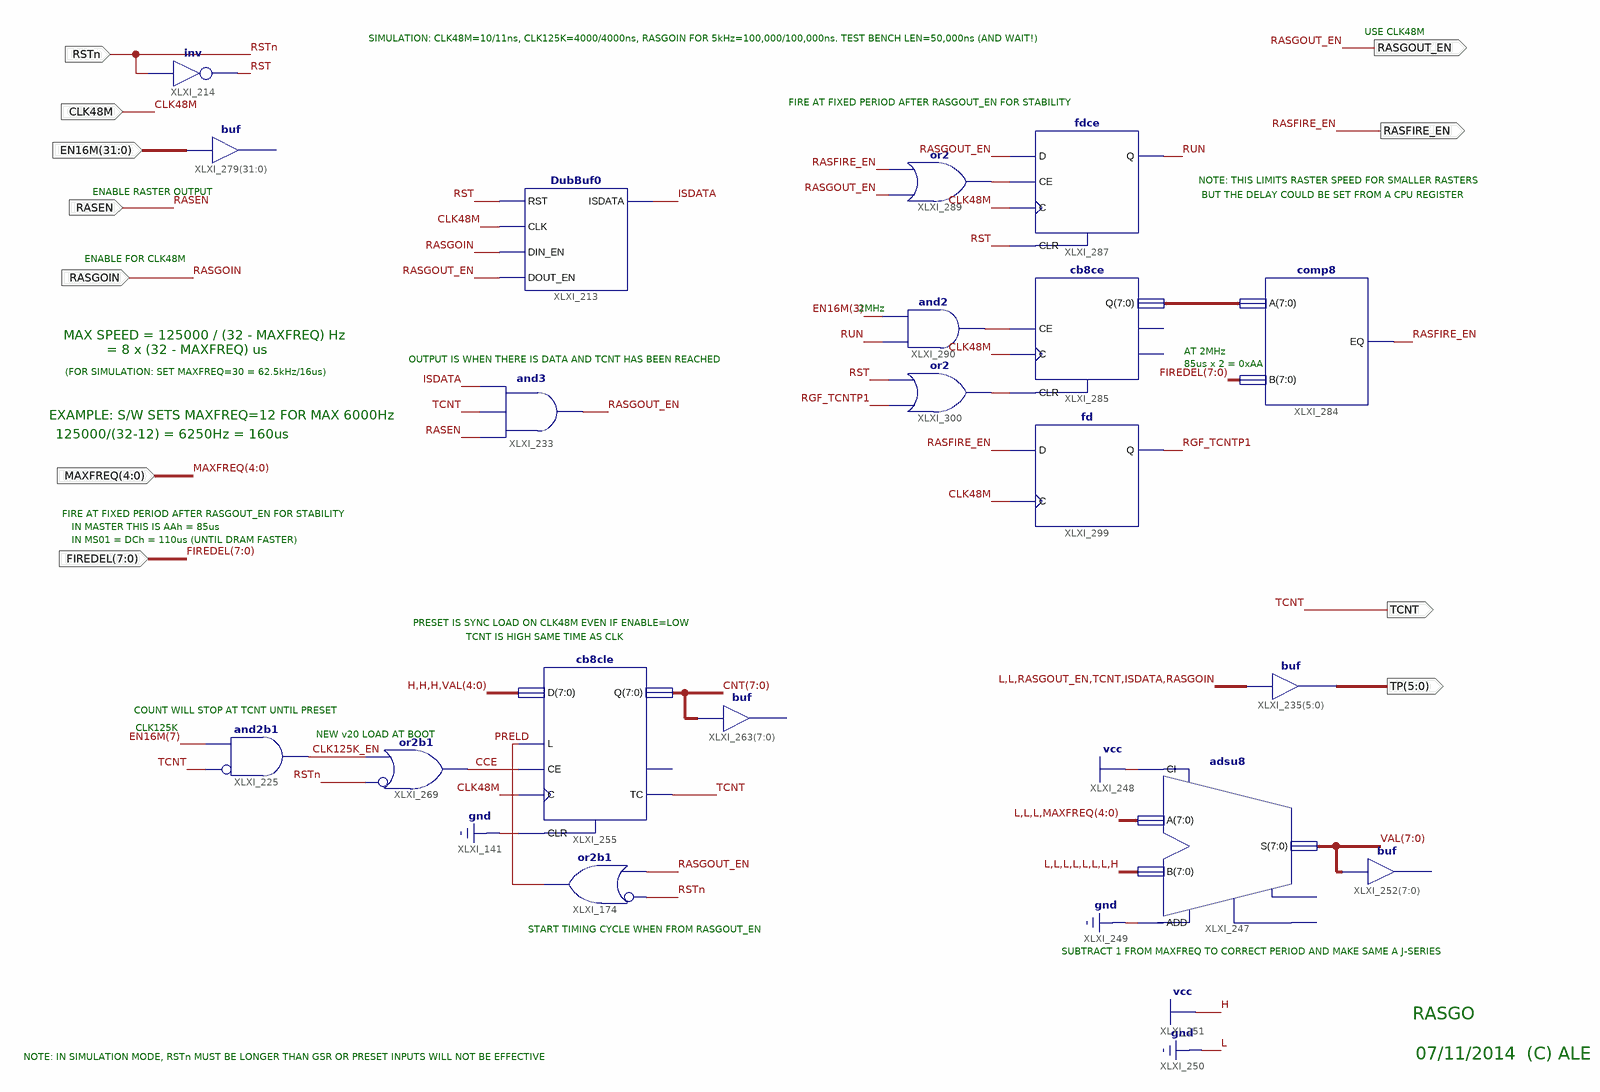
[diagram p0: schematic sheet 1]
// Xilinx ISE schematic RasGo.sch (zynq) as structural Verilog: 19 symbols, 11 ports
module RasGo (
  input  RASEN,
  input  RSTn,
  input  CLK48M,
  input  RASGOIN,
  input  [31:0] EN16M,
  input  [7:0] FIREDEL,
  input  [4:0] MAXFREQ,
  output RASGOUT_EN,
  output TCNT,
  output [5:0] TP,
  output RASFIRE_EN
);

  wire CCE, CLK125K_EN, ISDATA, PRELD, RGF_TCNTP1, RST, RUN, XLXN_504, XLXN_512, XLXN_543;
  wire [7:0] CNT, VAL, XLXN_535;

  not XLXI_214 (RST, RSTn);
  assign TP = {2'b00, RASGOUT_EN, TCNT, ISDATA, RASGOIN};  // buf XLXI_235[5..0], 6 bits wide
  adsu8 XLXI_247 (.A({3'b000, MAXFREQ}), .ADD(1'b0), .B(8'b00000001), .CI(1'b1), .S(VAL));  // open: CO, OFL
  // buf XLXI_252[7..0] has open pins: I=VAL, O=open
  // buf XLXI_279[31..0] has open pins: I=EN16M, O=open
  // buf XLXI_263[7..0] has open pins: I=CNT, O=open
  cb8cle XLXI_255 (
    .C(CLK48M), .CE(CCE), .CLR(1'b0), .D({3'b111, VAL[4:0]}), .L(PRELD), .Q(CNT), .TC(TCNT));  // open: CEO
  or XLXI_269 (CCE, ~RSTn, CLK125K_EN);  // or2b1
  or XLXI_174 (PRELD, ~RSTn, RASGOUT_EN);  // or2b1
  and XLXI_225 (CLK125K_EN, ~TCNT, EN16M[7]);  // and2b1
  and XLXI_233 (RASGOUT_EN, RASEN, TCNT, ISDATA);
  or XLXI_289 (XLXN_504, RASGOUT_EN, RASFIRE_EN);
  fdce XLXI_287 (.C(CLK48M), .CE(XLXN_504), .CLR(RST), .D(RASGOUT_EN), .Q(RUN));
  and XLXI_290 (XLXN_512, RUN, EN16M[3]);
  cb8ce XLXI_285 (.C(CLK48M), .CE(XLXN_512), .CLR(XLXN_543), .Q(XLXN_535));  // open: CEO, TC
  comp8 XLXI_284 (.A(XLXN_535), .B(FIREDEL), .EQ(RASFIRE_EN));
  or XLXI_300 (XLXN_543, RGF_TCNTP1, RST);
  fd XLXI_299 (.C(CLK48M), .D(RASFIRE_EN), .Q(RGF_TCNTP1));
  DubBuf0 XLXI_213 (.CLK(CLK48M), .DIN_EN(RASGOIN), .DOUT_EN(RASGOUT_EN), .ISDATA(ISDATA), .RST(RST));

  // Notes on the sheet:
  //   USE CLK48M
  //   SIMULATION: CLK48M=10/11ns, CLK125K=4000/4000ns, RASGOIN FOR 5kHz=100,000/100,000ns. TEST BENCH LEN=50,000ns (AND WAIT!)
  //   FIRE AT FIXED PERIOD AFTER RASGOUT_EN FOR STABILITY
  //   NOTE: THIS LIMITS RASTER SPEED FOR SMALLER RASTERS
  //   ENABLE RASTER OUTPUT
  //   BUT THE DELAY COULD BE SET FROM A CPU REGISTER
  //   ENABLE FOR CLK48M
  //   2MHz
  //   MAX SPEED = 125000 / (32 - MAXFREQ) Hz
  //   = 8 x (32 - MAXFREQ) us
  //   AT 2MHz
  //   OUTPUT IS WHEN THERE IS DATA AND TCNT HAS BEEN REACHED
  //   85us x 2 = 0xAA
  //   (FOR SIMULATION: SET MAXFREQ=30 = 62.5kHz/16us)
  //   EXAMPLE: S/W SETS MAXFREQ=12 FOR MAX 6000Hz
  //   125000/(32-12) = 6250Hz = 160us
  //   FIRE AT FIXED PERIOD AFTER RASGOUT_EN FOR STABILITY
  //   IN MASTER THIS IS AAh = 85us
  //   IN MS01 = DCh = 110us (UNTIL DRAM FASTER)
  //   PRESET IS SYNC LOAD ON CLK48M EVEN IF ENABLE=LOW
  //   TCNT IS HIGH SAME TIME AS CLK
  //   COUNT WILL STOP AT TCNT UNTIL PRESET
  //   CLK125K
  //   NEW v20 LOAD AT BOOT
  //   START TIMING CYCLE WHEN FROM RASGOUT_EN
  //   SUBTRACT 1 FROM MAXFREQ TO CORRECT PERIOD AND MAKE SAME A J-SERIES
  //   RASGO
  //   07/11/2014  (C) ALE
  //   NOTE: IN SIMULATION MODE, RSTn MUST BE LONGER THAN GSR OR PRESET INPUTS WILL NOT BE EFFECTIVE
endmodule
